# Altium schematic sheet Esquema_CPU.SchDoc
size A4
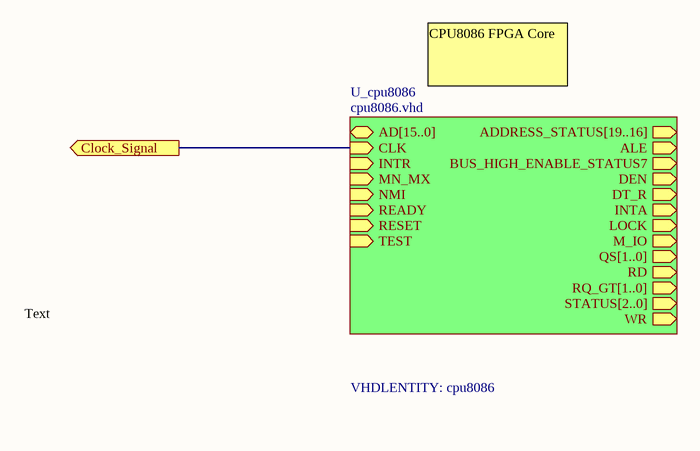
[diagram p0: Esquema_CPU.SchDoc]

## Sub-sheets
U_cpu8086 = cpu8086.vhd: AD[15..0] (bidir), ADDRESS_STATUS[19..16] (out), ALE (out), BUS_HIGH_ENABLE_STATUS7 (out), CLK (in), DEN (out), DT_R (out), INTA (out), INTR (in), LOCK (out), M_IO (out), MN_MX (in), NMI (in), QS[1..0] (out), RD (out), READY (in), RESET (in), RQ_GT[1..0] (out), STATUS[2..0] (out), TEST (in), WR (out)  | VHDLENTITY: cpu8086

## Ports
Clock_Signal (out)

## Nets
Clock_Signal: port Clock_Signal, sheet U_cpu8086/CLK

## Notes on the sheet
- CPU8086 FPGA Core
- Text